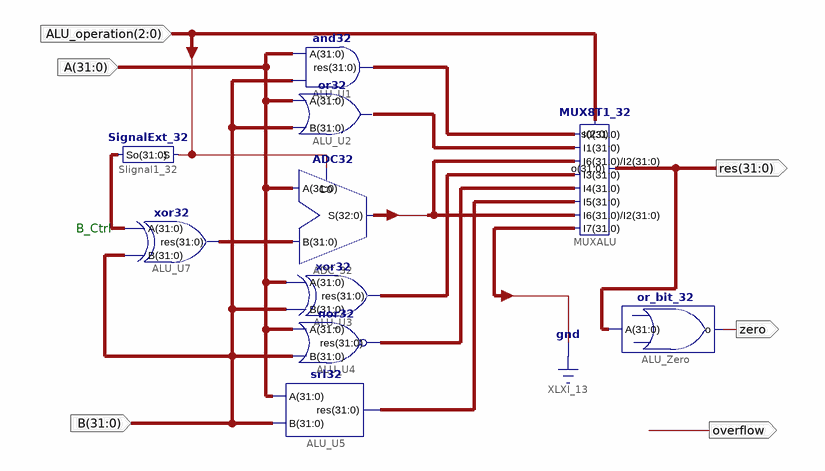
[diagram p0: schematic sheet 1]
// Xilinx ISE schematic alu.sch (kintex7) as structural Verilog: 10 symbols, 6 ports
module alu (
  input  [31:0] A,
  input  [31:0] B,
  input  [2:0] ALU_operation,
  output [31:0] res,
  output zero,
  output overflow
);

  wire [31:0] XLXN_11, XLXN_12, XLXN_22, XLXN_23, XLXN_47, XLXN_51, XLXN_55;
  wire [32:0] S;

  nor32 ALU_U4 (.res(XLXN_11), .A(A), .B(B));
  or32 ALU_U2 (.res(XLXN_23), .A(A), .B(B));
  and32 ALU_U1 (.res(XLXN_22), .A(A), .B(B));
  xor32 ALU_U3 (.A(A), .B(B), .res(XLXN_12));
  or_bit_32 ALU_Zero (.o(zero), .A(res));
  srl32 ALU_U5 (.A(A), .B(B), .res(XLXN_47));
  xor32 ALU_U7 (.A(XLXN_55), .B(B), .res(XLXN_51));
  SignalExt_32 SIignal1_32 (.So(XLXN_55), .S(ALU_operation[2]));
  ADC32 ADC_32 (.B(XLXN_51), .A(A), .C0(ALU_operation[2]), .S(S));
  MUX8T1_32 MUXALU (
    .s(ALU_operation), .I7({{31{1'b0}}, S[32]}), .I6(S[31:0]), .I5(XLXN_47), .I4(XLXN_11), .I3(XLXN_12),
    .I2(S[31:0]), .I1(XLXN_23), .I0(XLXN_22), .o(res));

  // Notes on the sheet:
  //   B_Ctrl
endmodule
